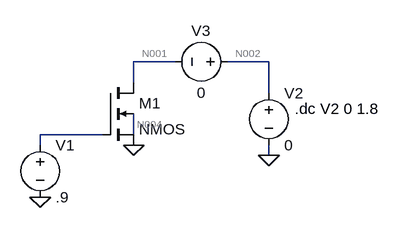
[diagram p0: schematic tut2 Q6.asc]
tut2 Q6.asc, the LTspice schematic file:
Version 4
SHEET 1 880 680
WIRE 256 32 192 32
WIRE 400 32 336 32
WIRE 192 64 192 32
WIRE 400 80 400 32
WIRE 144 144 48 144
WIRE 192 144 192 112
WIRE 48 160 48 144
WIRE 400 176 400 160
FLAG 48 240 0
FLAG 400 176 0
FLAG 192 160 0
SYMBOL voltage 48 144 R0
WINDOW 123 0 0 Left 2
WINDOW 39 0 0 Left 2
SYMATTR InstName V1
SYMATTR Value .9
SYMBOL voltage 400 64 R0
WINDOW 123 0 0 Left 2
WINDOW 39 0 0 Left 2
SYMATTR InstName V2
SYMATTR Value 0
SYMBOL nmos4 144 64 R0
SYMATTR InstName M1
SYMATTR Value2 l=5 w=.36
SYMBOL voltage 352 32 R90
WINDOW 0 -32 56 VBottom 2
WINDOW 3 32 56 VTop 2
WINDOW 123 0 0 Left 2
WINDOW 39 0 0 Left 2
SYMATTR InstName V3
SYMATTR Value 0
TEXT 440 104 Left 2 !.dc V2 0 1.8

The netlist it stands for:
* tut2 Q6.asc
V1 N003 0 .9
V2 N002 0 0
M1 N001 N003 0 N004 NMOS l=5 w=.36
V3 N002 N001 0
.model NMOS NMOS
.model PMOS PMOS
.lib standard.mos
.dc V2 0 1.8
.backanno
.end

* Results of the author's LTspice run, read from the files saved beside the schematic
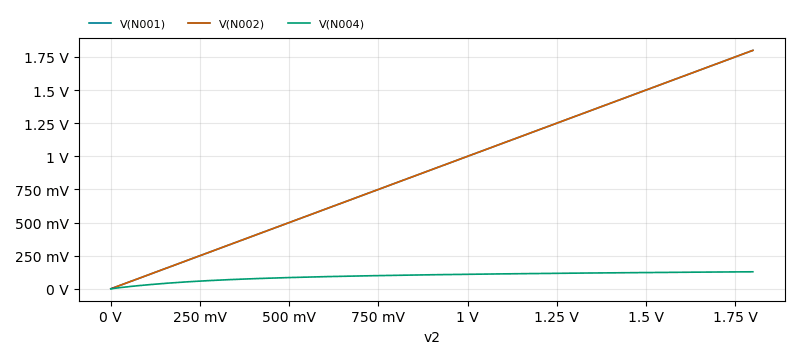
[diagram p1: DC transfer characteristic of tut2 Q6.asc, plotted from the saved traces]
* DC transfer characteristic, 1 run:
*   V(N001): 0 V at v2=0 V, 1.8 V at v2=1.8 V, min 0 V, max 1.8 V
*   V(N002): 0 V at v2=0 V, 1.8 V at v2=1.8 V, min 0 V, max 1.8 V
*   V(N004): 95.37 fV at v2=0 V, 128.4 mV at v2=1.8 V, min 95.37 fV, max 128.4 mV